# Altium project AirPort.PrjPcb
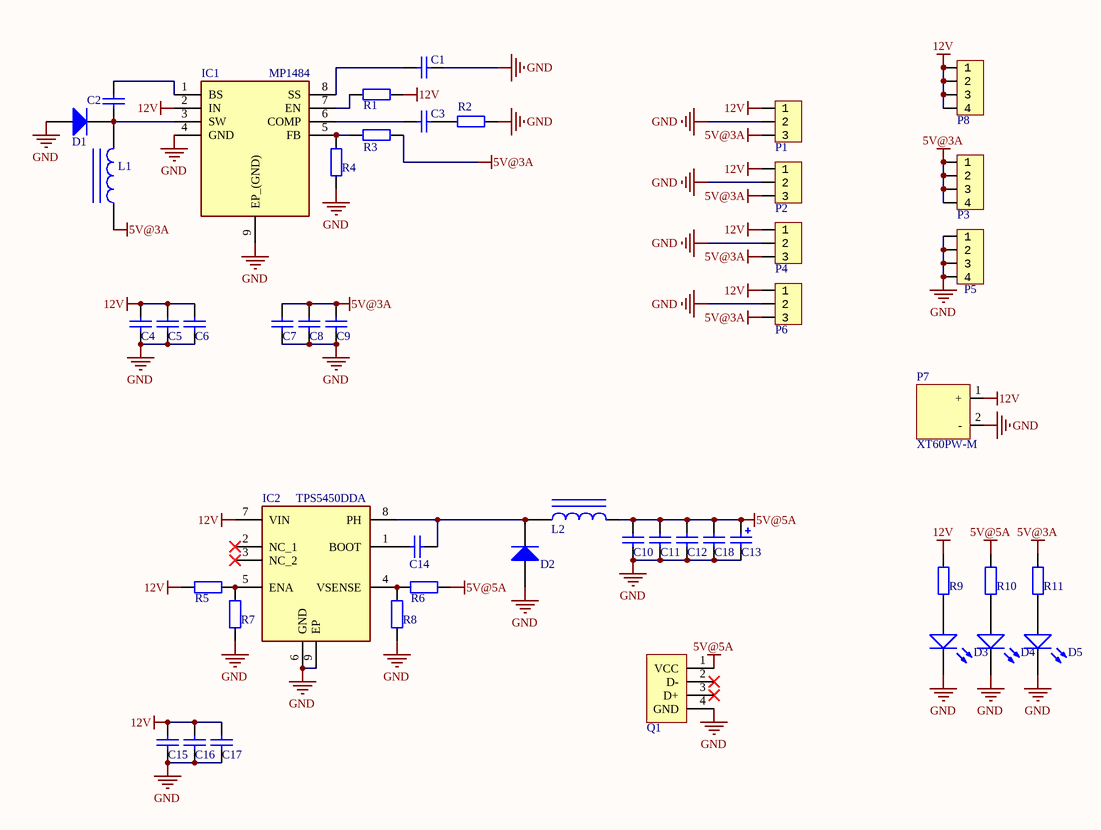
[diagram p0: AirPort_V1.0.SchDoc]
1 sheet, 47 parts. Net scope: global (net labels, ports and power ports of the same name join across sheets).
Board file: AirPort_V1.0.PcbDoc

## Sheet AirPort_V1.0.SchDoc
size 292 x 193 mm; Website: wiki-power.com

### Parts
C1  100nF  [CAP-0603]  (value not drawn)
C2  10nF  [CAP-0603]  (value not drawn)
C3  6.8nF  [CAP-0603]  (value not drawn)
C4  10uF  [CAP-1206]  (value not drawn)
C5  10uF  [CAP-1206]  (value not drawn)
C6  10uF  [CAP-1206]  (value not drawn)
C7  10uF  [CAP-1206]  (value not drawn)
C8  10uF  [CAP-1206]  (value not drawn)
C9  10uF  [CAP-1206]  (value not drawn)
C10  10uF  [CAP-1206]  (value not drawn)
C11  10uF  [CAP-1206]  (value not drawn)
C12  0.01uF  [CAP-0603]  (value not drawn)
C13  330uF  [CAP-2.5*6.3*11.2-H - GD]  (value not drawn)
C14  0.01uF  [CAP-0603]  (value not drawn)
C15  4.7uF  [CAP-1206]  (value not drawn)
C16  4.7uF  [CAP-1206]  (value not drawn)
C17  0.01uF  [CAP-1206]  (value not drawn)
C18  0.01uF  [CAP-0603]  (value not drawn)
D1  1N4007  [SOD_123]  (value not drawn)
D2  B540C  [DO-214AB]  (value not drawn)
D3  RED  [LED-0603]  (value not drawn)
D4  RED  [LED-0603]  (value not drawn)
D5  RED  [LED-0603]  (value not drawn)
IC1  MP1484  [SOIC_8_PAD]
IC2  TPS5450DDA  [SOIC_8_PAD]
L1  10uH  [XAL6060-103MEB]  (value not drawn)
L2  15uH  [SMD-13.45x12.6x4.8mm]  (value not drawn)
P1  XH-3AW  [XH_3]  (value not drawn)
P2  XH-3AW  [XH_3]  (value not drawn)
P3  HDR1x4_2.54  [HDR1x4_2.54_180]  (value not drawn)
P4  XH-3AW  [XH_3]  (value not drawn)
P5  HDR1x4_2.54  [HDR1x4_2.54_180]  (value not drawn)
P6  XH-3AW  [XH_3]  (value not drawn)
P7  XT60PW-M  [XT60PW-M]
P8  HDR1x4_2.54  [HDR1x4_2.54_180]  (value not drawn)
Q1  USB A  [USB_A_MALE_4_POS_Solder_RA_SMD_4_Terminal_1_Port]  (value not drawn)
R1  100K  [R-0603]  (value not drawn)
R2  6.8K  [R-0603]  (value not drawn)
R3  44.2K  [R-0603]  (value not drawn)
R4  10K  [R-0603]  (value not drawn)
R5  15K  [R-0603]  (value not drawn)
R6  10K  [R-0603]  (value not drawn)
R7  10K  [R-0603]  (value not drawn)
R8  3.16K  [R-0603]  (value not drawn)
R9  10k  [R-0603]  (value not drawn)
R10  10k  [R-0603]  (value not drawn)
R11  10k  [R-0603]  (value not drawn)

### Nets
5V@3A: C7.2 C8.2 C9.2 L1.1 P1.3 P2.3 P3.1 P3.2 P3.3 P3.4 P4.3 P6.3 R3.2 R11.2
5V@5A: C10.2 C11.2 C12.2 C13.1 C18.2 L2.2 Q1.1(VCC) R6.1 R10.2
12V: C4.2 C5.2 C6.2 C15.2 C16.2 C17.2 IC1.2(IN) IC2.7(VIN) P1.1 P2.1 P4.1 P6.1 P7.1(+) P8.1 P8.2 P8.3 P8.4 R1.2 R5.2 R9.2
GND: C1.1 C4.1 C5.1 C6.1 C7.1 C8.1 C9.1 C10.1 C11.1 C12.1 C13.2 C15.1 C16.1 C17.1 C18.1 D1.1(A) D2.1(A) D3.K D4.K D5.K IC1.4(GND) IC1.9(EP_(GND)) IC2.6(GND) IC2.9(EP) P1.2 P2.2 P4.2 P5.1 P5.2 P5.3 P5.4 P6.2 P7.2(-) Q1.4(GND) R2.2 R4.1 R7.2 R8.1
NetC1_2: C1.2 IC1.8(SS)
NetC2_1: C2.1 D1.2(K) IC1.3(SW) L1.2
NetC2_2: C2.2 IC1.1(BS)
NetC3_1: C3.1 R2.1
NetC3_2: C3.2 IC1.6(COMP)
NetC14_1: C14.1 D2.2(K) IC2.8(PH) L2.1
NetC14_2: C14.2 IC2.1(BOOT)
NetD3_A: D3.A R9.1
NetD4_A: D4.A R10.1
NetD5_A: D5.A R11.1
NetIC1_5: IC1.5(FB) R3.1 R4.2
NetIC1_7: IC1.7(EN) R1.1
NetIC2_4: IC2.4(VSENSE) R6.2 R8.2
NetIC2_5: IC2.5(ENA) R5.1 R7.1

Not connected (* = marked no-connect by the designer): IC2 2(NC_1)* 3(NC_2)*; Q1 2(D-)* 3(D+)*

### Notes on the sheet
- Author
- DocumentName
- ModifiedDate
- ProjectName
- SheetNumber
- SheetTotal
- Website
- Revision

### Library data of the parts
C1-C12 C14-C18 = CAP: 贴片电容; ComponentLink1Description: 供应商链接; ComponentLink1URL: http://www.szlcsc.com/product/details_53938.html; Package: 0402; Supplier: LC; SuppliersPartNumber: C52923
C13 = CAP-POL: 贴片电容-有极性; ComponentLink1Description: 供应商链接; ComponentLink1URL: http://www.szlcsc.com/product/details_16815.html; Package: 3528; Supplier: LC; SuppliersPartNumber: C16133
D1 = DIODE: M7 二极管; ComponentLink1Description: 供应商链接; ComponentLink1URL: http://www.szlcsc.com/product/details_23178.html; Package: SMA(DO-214AC); Supplier: LC; SuppliersPartNumber: C22452
D2 = DIODE: 二极管; ComponentLink1Description: 供应商链接; ComponentLink1URL: http://www.szlcsc.com/product/details_23178.html; Package: SMA(DO-214AC); Supplier: LC; SuppliersPartNumber: C22452
D3-D5 = LED: 发光二极管; pin to pad: A>1 K>2; ComponentLink1Description: 供应商链接; ComponentLink1URL: http://www.szlcsc.com/product/details_2663.html; Package: 0603; Supplier: LC; SuppliersPartNumber: C2290
IC1 = MP1484: 同步降压稳压器; Manufacturer_Name: Monolithic Power Systems (MPS); Manufacturer_Part_Number: MP1484EN-LF; Datasheet Link: http://www.mouser.com/datasheet/2/277/MP1484-1186021.pdf; Height: 1.7mm; Mouser Part Number: 946-MP1484ENLF; Mouser Price/Stock: https://www.mouser.com/Search/Refine.aspx?Keyword=946-MP1484ENLF
IC2 = TPS5450DDA: 集成稳压芯片; Manufacturer_Name: Texas Instruments; Datasheet Link: http://www.ti.com/lit/ds/symlink/tps5450.pdf; Height: 1.7mm; Manufacturer_Part_Number: TPS5450DDA; Arrow Part Number: TPS5450DDA; Arrow Price/Stock: https://www.arrow.com/en/products/tps5450dda/texas-instruments; Mouser Part Number: 595-TPS5450DDA; Mouser Price/Stock: https://www.mouser.co.uk/ProductDetail/Texas-Instruments/TPS5450DDA?qs=h%2FYsCRHtaqPow3uMxnjN5A%3D%3D
L1 = INDUCTOR: 贴片电感 5A; ComponentLink1Description: 供应商链接; ComponentLink1URL: http://www.szlcsc.com/product/details_33003.html; Package: 0402; Supplier: LC; SuppliersPartNumber: C32041
L2 = INDUCTOR: 8A 贴片电感CMKD-1350A-150M; ComponentLink1Description: 供应商链接; ComponentLink1URL: http://www.szlcsc.com/product/details_33003.html; Package: 0402; Supplier: LC; SuppliersPartNumber: C32041
P1 P2 P4 P6 = HDR1x3_2.54: Header
P3 P5 P8 = HDR1x4_2.54: Header
P7 = XT60
Q1 = USB A: USB 接口
R1-R11 = RES: 贴片电阻; Package: 0805; Supplier: LC; SuppliersPartNumber: C17798